# EasyEDA schematic SCH_MI.L_2024-02-24.json
TITLE: Mi.L; REV: 6.0; Date: 2022-04-11; Sheet: 1/1; Drawn By: 18102521490AA; Company: Your Company
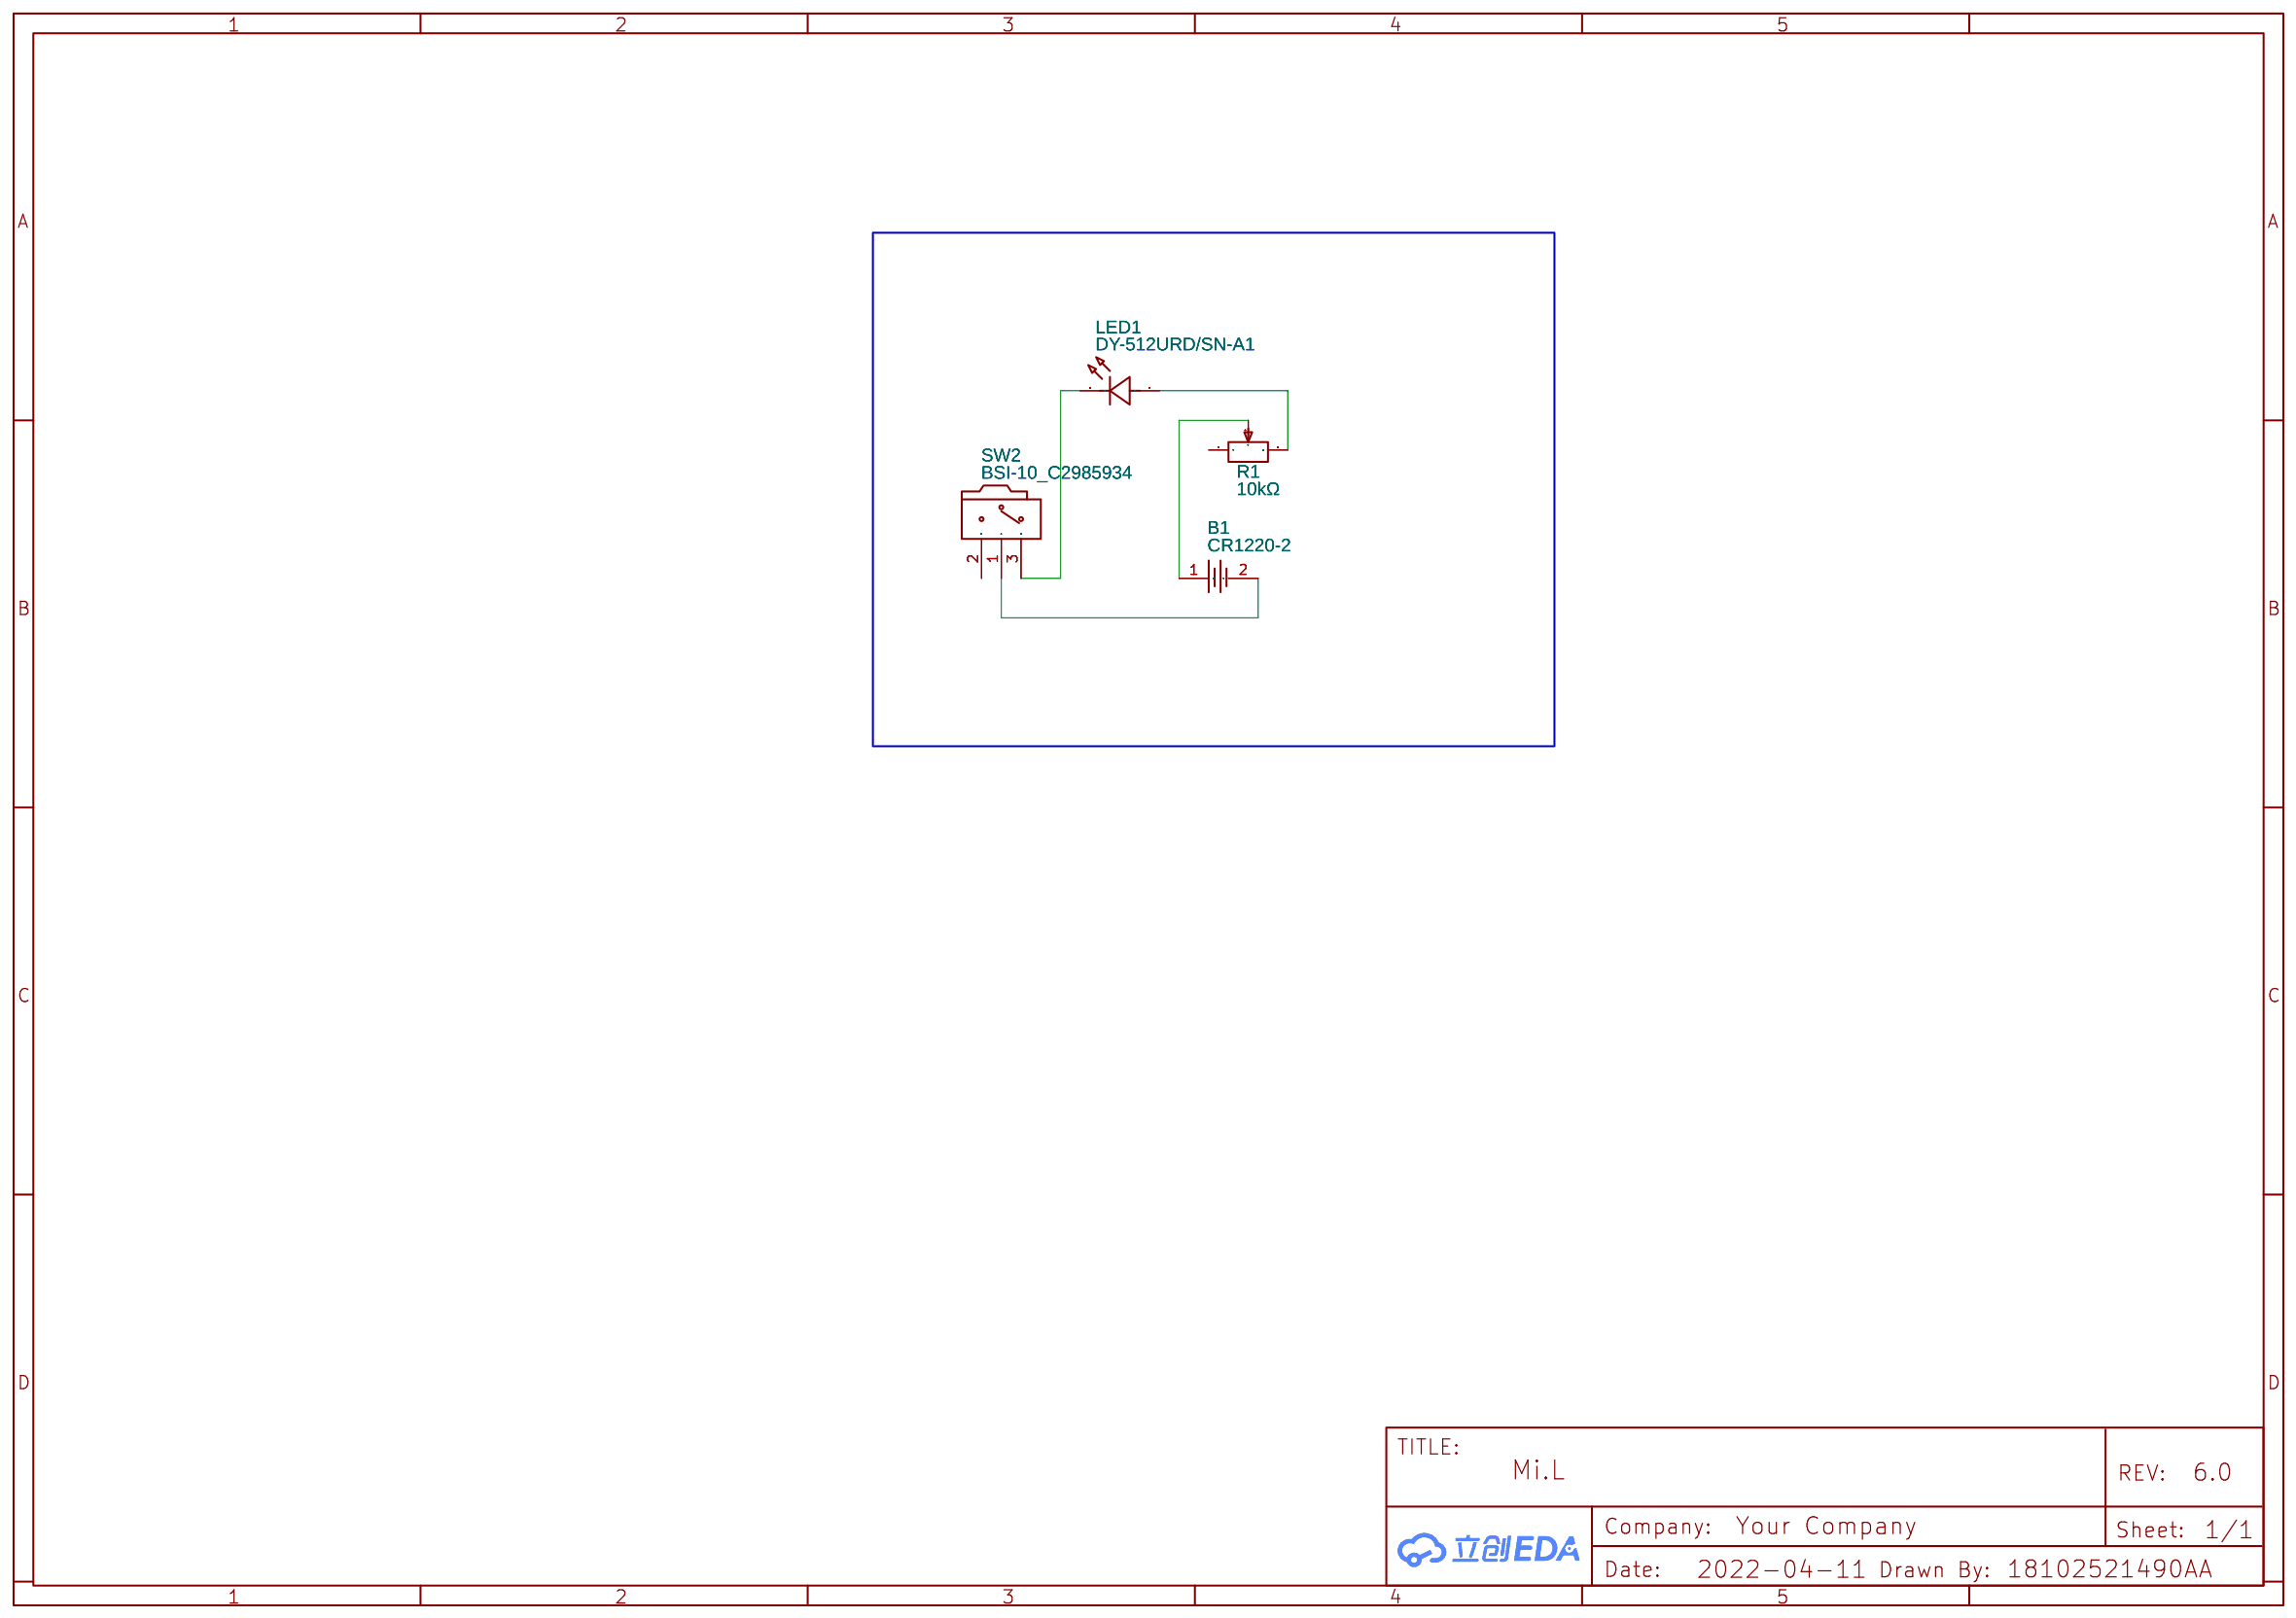
[diagram p0: schematic sheet]

## Parts
B1  CR1220-2  [BAT-SMD_CR1220-2]
LED1  DY-512URD/SN-A1  [LED-TH_L3.2-W2.0-P2.54-FD]
R1  10kΩ  [R09-5KΩ]
SW2  BSI-10_C2985934  [SW-TH_BSI-10]

## Library data of the parts
B1 = CR1220-2: Supplier: LCSC; Manufacturer: Q&J; Supplier Part: C70381; JLCPCB Part Class: Extended Part
LED1 = DY-512URD/SN-A1: Supplier: LCSC; Supplier Part: C841518; Manufacturer: TONYU(东裕); Contributor: lcsc
R1 = EVM2GSX80B14: Supplier: LCSC; Manufacturer: PANASONIC; Resistance(Ohms): 10K; Supplier Part: C72381; Resistance (Ohms): 10K; Package Display: No
SW2 = BSI-10_C2985934: Supplier: LCSC; Supplier Part: C2985934; Manufacturer: SM Switch; Manufacturer Part: BSI-10; link: https://atta.szlcsc.com/upload/public/pdf/source/20220328/3D4D6021904ADB20DC9F4CC49FD198C4.pdf; Contributor: LCSC

## Nets
Net-(B1-1): B1.1 R1.2
Net-(B1-2): B1.2 SW2.1
Net-(LED1-1): LED1.1(A) R1.3
Net-(LED1-2): LED1.2(K) SW2.3

Not connected (* = marked no-connect by the designer): R1 1; SW2 2
